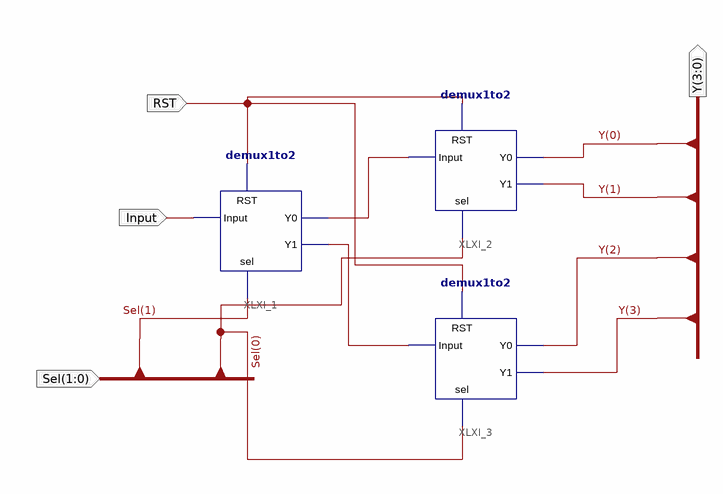
[diagram p0: schematic sheet 1]
// Xilinx ISE schematic demux1to4.sch (artix7) as structural Verilog: 3 symbols, 4 ports
module demux1to4 (
  input  RST,
  input  Input,
  input  [1:0] Sel,
  output [3:0] Y
);

  wire XLXN_2, XLXN_3;

  demux1to2 XLXI_1 (.Input(Input), .RST(RST), .sel(Sel[1]), .Y0(XLXN_2), .Y1(XLXN_3));
  demux1to2 XLXI_2 (.Input(XLXN_2), .RST(RST), .sel(Sel[0]), .Y0(Y[0]), .Y1(Y[1]));
  demux1to2 XLXI_3 (.Input(XLXN_3), .RST(RST), .sel(Sel[0]), .Y0(Y[2]), .Y1(Y[3]));
endmodule
